# EAGLE design maho-splitter (EAGLE 4.16)
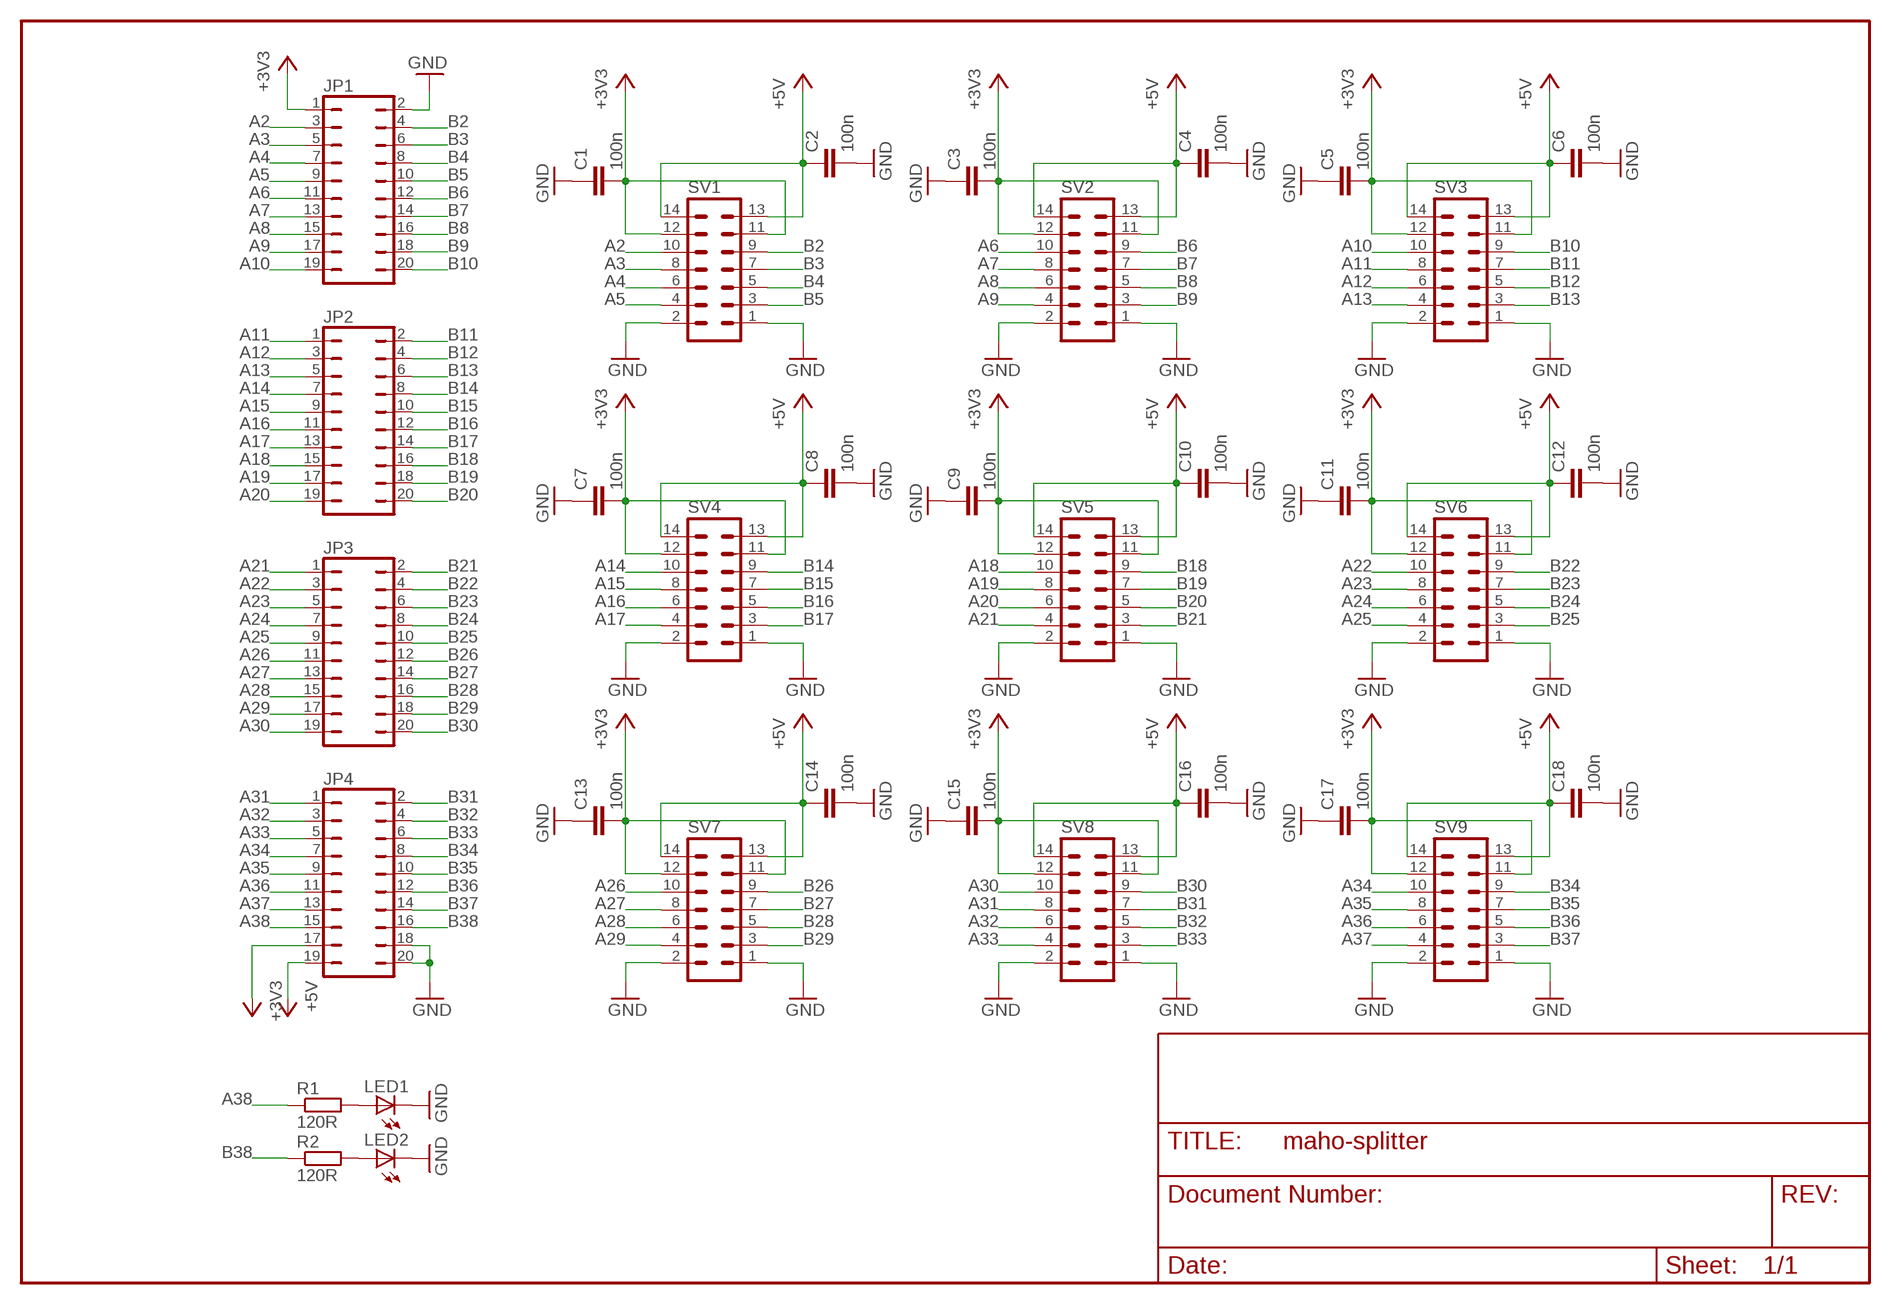
[diagram p0: schematic, sheet 1]

## Parts
C1  100n  C-EUC0603K  [C0603K]
C2  100n  C-EUC0603K  [C0603K]
C3  100n  C-EUC0603K  [C0603K]
C4  100n  C-EUC0603K  [C0603K]
C5  100n  C-EUC0603K  [C0603K]
C6  100n  C-EUC0603K  [C0603K]
C7  100n  C-EUC0603K  [C0603K]
C8  100n  C-EUC0603K  [C0603K]
C9  100n  C-EUC0603K  [C0603K]
C10  100n  C-EUC0603K  [C0603K]
C11  100n  C-EUC0603K  [C0603K]
C12  100n  C-EUC0603K  [C0603K]
C13  100n  C-EUC0603K  [C0603K]
C14  100n  C-EUC0603K  [C0603K]
C15  100n  C-EUC0603K  [C0603K]
C16  100n  C-EUC0603K  [C0603K]
C17  100n  C-EUC0603K  [C0603K]
C18  100n  C-EUC0603K  [C0603K]
JP1  JP10Q  [JP10Q]
JP2  JP10Q  [JP10Q]
JP3  JP10Q  [JP10Q]
JP4  JP10Q  [JP10Q]
LED1  LEDCHIP-LED0805  [CHIP-LED0805]
LED2  LEDCHIP-LED0805  [CHIP-LED0805]
R1  120R  R-EU_R0805  [R0805]
R2  120R  R-EU_R0805  [R0805]
SV1  ML14  [ML14]
SV2  ML14  [ML14]
SV3  ML14  [ML14]
SV4  ML14  [ML14]
SV5  ML14  [ML14]
SV6  ML14  [ML14]
SV7  ML14  [ML14]
SV8  ML14  [ML14]
SV9  ML14  [ML14]

## Nets
+3V3: C1.2 C3.2 C5.2 C7.2 C9.2 C11.2 C13.2 C15.2 C17.2 JP1.1 JP4.17 SV1.11 SV1.12 SV2.11 SV2.12 SV3.11 SV3.12 SV4.11 SV4.12 SV5.11 SV5.12 SV6.11 SV6.12 SV7.11 SV7.12 SV8.11 SV8.12 SV9.11 SV9.12
+5V: C2.1 C4.1 C6.1 C8.1 C10.1 C12.1 C14.1 C16.1 C18.1 JP4.19 SV1.13 SV1.14 SV2.13 SV2.14 SV3.13 SV3.14 SV4.13 SV4.14 SV5.13 SV5.14 SV6.13 SV6.14 SV7.13 SV7.14 SV8.13 SV8.14 SV9.13 SV9.14
A2: JP1.3 SV1.10
A3: JP1.5 SV1.8
A4: JP1.7 SV1.6
A5: JP1.9 SV1.4
A6: JP1.11 SV2.10
A7: JP1.13 SV2.8
A8: JP1.15 SV2.6
A9: JP1.17 SV2.4
A10: JP1.19 SV3.10
A11: JP2.1 SV3.8
A12: JP2.3 SV3.6
A13: JP2.5 SV3.4
A14: JP2.7 SV4.10
A15: JP2.9 SV4.8
A16: JP2.11 SV4.6
A17: JP2.13 SV4.4
A18: JP2.15 SV5.10
A19: JP2.17 SV5.8
A20: JP2.19 SV5.6
A21: JP3.1 SV5.4
A22: JP3.3 SV6.10
A23: JP3.5 SV6.8
A24: JP3.7 SV6.6
A25: JP3.9 SV6.4
A26: JP3.11 SV7.10
A27: JP3.13 SV7.8
A28: JP3.15 SV7.6
A29: JP3.17 SV7.4
A30: JP3.19 SV8.10
A31: JP4.1 SV8.8
A32: JP4.3 SV8.6
A33: JP4.5 SV8.4
A34: JP4.7 SV9.10
A35: JP4.9 SV9.8
A36: JP4.11 SV9.6
A37: JP4.13 SV9.4
A38: JP4.15 R1.1
B2: JP1.4 SV1.9
B3: JP1.6 SV1.7
B4: JP1.8 SV1.5
B5: JP1.10 SV1.3
B6: JP1.12 SV2.9
B7: JP1.14 SV2.7
B8: JP1.16 SV2.5
B9: JP1.18 SV2.3
B10: JP1.20 SV3.9
B11: JP2.2 SV3.7
B12: JP2.4 SV3.5
B13: JP2.6 SV3.3
B14: JP2.8 SV4.9
B15: JP2.10 SV4.7
B16: JP2.12 SV4.5
B17: JP2.14 SV4.3
B18: JP2.16 SV5.9
B19: JP2.18 SV5.7
B20: JP2.20 SV5.5
B21: JP3.2 SV5.3
B22: JP3.4 SV6.9
B23: JP3.6 SV6.7
B24: JP3.8 SV6.5
B25: JP3.10 SV6.3
B26: JP3.12 SV7.9
B27: JP3.14 SV7.7
B28: JP3.16 SV7.5
B29: JP3.18 SV7.3
B30: JP3.20 SV8.9
B31: JP4.2 SV8.7
B32: JP4.4 SV8.5
B33: JP4.6 SV8.3
B34: JP4.8 SV9.9
B35: JP4.10 SV9.7
B36: JP4.12 SV9.5
B37: JP4.14 SV9.3
B38: JP4.16 R2.1
GND: C1.1 C2.2 C3.1 C4.2 C5.1 C6.2 C7.1 C8.2 C9.1 C10.2 C11.1 C12.2 C13.1 C14.2 C15.1 C16.2 C17.1 C18.2 JP1.2 JP4.18 JP4.20 LED1.C LED2.C SV1.1 SV1.2 SV2.1 SV2.2 SV3.1 SV3.2 SV4.1 SV4.2 SV5.1 SV5.2 SV6.1 SV6.2 SV7.1 SV7.2 SV8.1 SV8.2 SV9.1 SV9.2
N$1: LED1.A R1.2
N$2: LED2.A R2.2

## Library data of the parts
C1-C18 = rcl:C-EU: CAPACITOR, European symbol
JP1-JP4 = jumper:JP10Q: JUMPER
LED1 LED2 = led:LED: LED OSRAM: - CHIPLED LG R971, LG N971, LY N971, LG Q971, LY Q971, LO R971, LY R971 LH N974, LH R974 LS Q976, LO Q976, LY Q976 LO Q996 - Hyper CHIPLED LW Q18S LB Q993, LB Q99A, LB R99A - SideLED LS A670, LO A670, LY A670, LG A670, LP A670 LB A673, LV A673, LT A673, LW A673 LH A674 LY A675 LS A676, LA A676, LO A676, LY A676, LW A676 LS A679, LY A679, LG A679 - Hyper Micro SIDELED® LS Y876, LA Y876, LO Y876, LY Y876 LT Y87S - SmartLED LW L88C, LW L88S LB L89C, LB L89S, LG L890 LS L89K, LO L89K, LY L89K LS L896, LA L896, LO L896, LY L896 - TOPLED LS T670, LO T670, LY T670, LG T670, LP T670 LSG T670, LSP T670, LSY T670, LOP T670, LYG T670 LG T671, LOG T671, LSG T671 LB T673, LV T673, LT T673, LW T673 LH T674 LS T676, LA T676, LO T676, LY T676, LB T676, LH T676, LSB T676, LW T676 LB T67C, LV T67C, LT T67C, LS T67K, LO T67K, LY T67K, LW E67C LS E67B, LA E67B, LO E67B, LY E67B, LB E67C, LV E67C, LT E67C LW T67C LS T679, LY T679, LG T679 LS T770, LO T770, LY T770, LG T770, LP T770 LB T773, LV T773, LT T773, LW T773 LH T774 LS E675, LA E675, LY E675, LS T675 LS T776, LA T776, LO T776, LY T776, LB T776 LHGB T686 LT T68C, LB T68C - Hyper Mini TOPLED® LB M676 - Mini TOPLED Santana® LG M470 LS M47K, LO M47K, LY M47K Source: http://www.osram.convergy.de - LUMILED® LXK2-PW12-R00, LXK2-PW12-S00, LXK2-PW14-U00, LXK2-PW14-V00 LXK2-PM12-R00, LXK2-PM12-S00, LXK2-PM14-U00 LXK2-PE12-Q00, LXK2-PE12-R00, LXK2-PE12-S00, LXK2-PE14-T00, LXK2-PE14-U00 LXK2-PB12-K00, LXK2-PB12-L00, LXK2-PB12-M00, LXK2-PB14-N00, LXK2-PB14-P00, LXK2-PB14-Q00 LXK2-PR12-L00, LXK2-PR12-M00, LXK2-PR14-Q00, LXK2-PR14-R00 LXK2-PD12-Q00, LXK2-PD12-R00, LXK2-PD12-S00 LXK2-PH12-R00, LXK2-PH12-S00 LXK2-PL12-P00, LXK2-PL12-Q00, LXK2-PL12-R00 Source: www.luxeon.com
R1 R2 = rcl:R-EU_: RESISTOR, European symbol
SV1-SV9 = con-harting-ml:ML14: HARTING

## Board
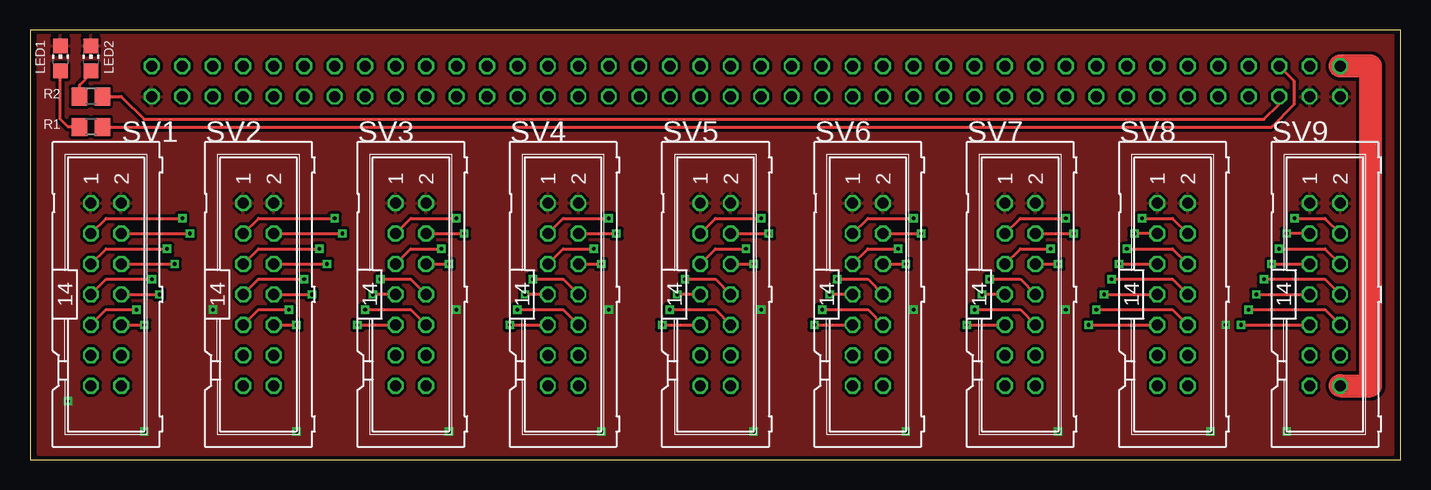
[diagram p1: board, top side]
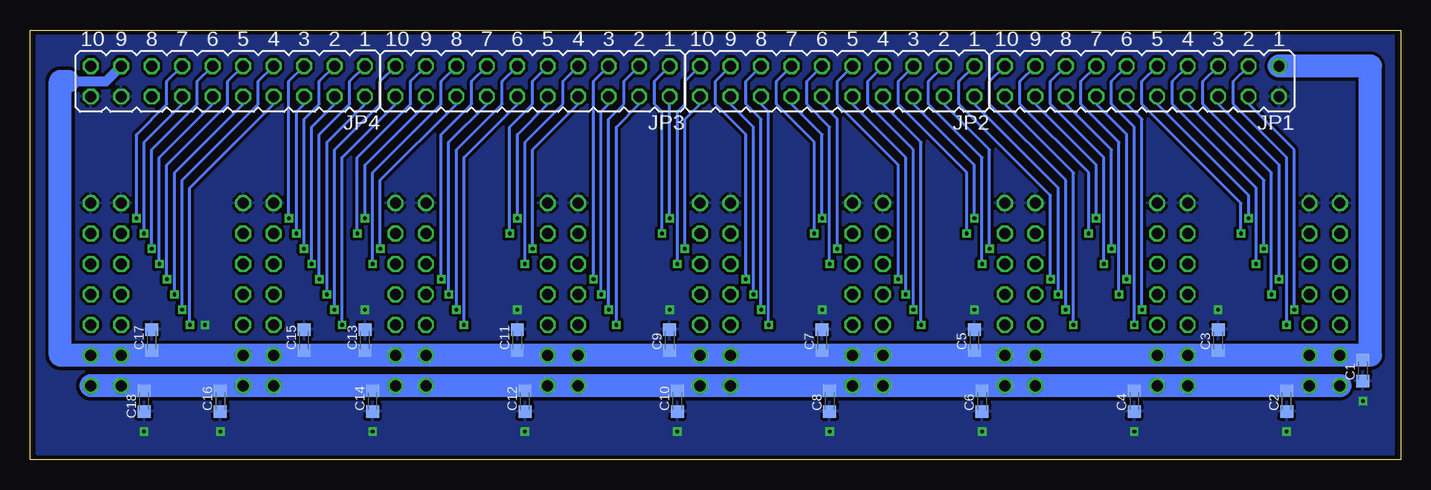
[diagram p2: board, bottom side, seen from below]

Size 114.28 x 35.87 mm. Coordinates in mm from the lower left corner, seen from the top.
Outline: 0,0 114.28,0 114.28,35.87 0,35.87 0,0
Copper layers (1+2*15+16): Top 0.035mm / dielectric 0.15mm / Route2 0.018mm / dielectric 1.5mm / Route15 0.018mm / dielectric 0.15mm / Bottom 0.035mm
Design rules "eurocircuits_class5": minimum track width 0.15mm, minimum drill 0.2mm, track to track 0.15mm, track to pad 0.15mm, pad to pad 0.15mm, via to via 0.15mm, smd to smd 0mil, copper to edge 0.2mm, drill to drill 0.2mm, minimum pad ring 0.2mm, minimum via ring 0.2mm, stop-mask expansion 4mil, vias tented up to drill 0mil, thermal gap 10mil

### Footprints (pad centres in the part's own frame; a part is rotated, then mirrored left to right if it is on the bottom)
C0603K = smd 1.05 x 1.08: 1 -0.875,0; 2 0.875,0
JP10Q = drill 0.914 octagon: 1 -11.43,-1.27; 2 -11.43,1.27; 3 -8.89,-1.27; 4 -8.89,1.27; 5 -6.35,-1.27; 6 -6.35,1.27; 7 -3.81,-1.27; 8 -3.81,1.27; 9 -1.27,-1.27; 10 -1.27,1.27; 11 1.27,-1.27; 12 1.27,1.27; 13 3.81,-1.27; 14 3.81,1.27; 15 6.35,-1.27; 16 6.35,1.27; 17 8.89,-1.27; 18 8.89,1.27; 19 11.43,-1.27; 20 11.43,1.27
CHIP-LED0805 = smd 1.2 x 1.2: A 0,-1.05; C 0,1.05
R0805 = smd 1.3 x 1.5: 1 -0.95,0; 2 0.95,0
ML14 = drill 0.914 octagon: 1 -7.62,-1.27; 2 -7.62,1.27; 3 -5.08,-1.27; 4 -5.08,1.27; 5 -2.54,-1.27; 6 -2.54,1.27; 7 0,-1.27; 8 0,1.27; 9 2.54,-1.27; 10 2.54,1.27; 11 5.08,-1.27; 12 5.08,1.27; 13 7.62,-1.27; 14 7.62,1.27

### Placement (x,y rotation side)
C1  3.17,7.46 90 bottom
C2  9.52,4.92 270 bottom
C3  15.24,10 270 bottom
C4  22.22,4.92 270 bottom
C5  35.55,10 270 bottom
C6  34.92,4.92 270 bottom
C7  48.26,10 270 bottom
C8  47.62,4.92 270 bottom
C9  60.96,10 270 bottom
C10  60.32,4.92 270 bottom
C11  73.66,10 270 bottom
C12  73.02,4.92 270 bottom
C13  86.35,10 270 bottom
C14  85.72,4.92 270 bottom
C15  91.44,10 270 bottom
C16  98.42,4.92 270 bottom
C17  104.13,10 270 bottom
C18  104.77,4.92 270 bottom
JP1  21.58,31.58 180 bottom
JP2  46.98,31.58 180 bottom
JP3  72.38,31.58 180 bottom
JP4  97.78,31.58 180 bottom
LED1  2.54,33.49 0 top
LED2  5.08,33.49 0 top
R1  5.08,27.77 180 top
R2  5.08,30.31 180 top
SV1  6.34,13.81 270 top
SV2  19.04,13.81 270 top
SV3  31.74,13.81 270 top
SV4  44.45,13.81 270 top
SV5  57.15,13.81 270 top
SV6  69.84,13.81 270 top
SV7  82.55,13.81 270 top
SV8  95.24,13.81 270 top
SV9  107.94,13.81 270 top

### Tracks (layer width: path | path; a pad name or v marks a point on that pad's centre or on a via)
+3V3
  Bottom 0.254: C5.2 35.16,8.73 SV3.12 | C7.2 47.86,8.73 SV4.12 | C9.2 60.56,8.73 SV5.12 | C11.2 73.26,8.73 SV6.12 | C17.2 104.53,8.73 SV9.11 | C13.2 85.96,8.73 SV7.12 | C15.2 91.83,8.73 SV8.11 | C1.2 3.56,8.73 SV1.11 | C3.2 15.24,9.36 15.87,8.73 SV2.11
  Bottom 0.813: JP4.17 107.94,31.58 111.12,31.58
  Bottom 1.93: JP1.1 2.54,32.85 2.54,8.73 SV1.11 SV1.12 SV2.11 SV2.12 SV3.11 SV3.12 SV4.11 SV4.12 SV5.11 SV5.12 SV6.11 SV6.12 SV7.11 SV7.12 SV8.11 SV8.12 SV9.11 SV9.12 111.75,8.73 111.75,31.58 111.12,31.58
+5V
  Top 1.93: SV9.14 111.75,6.18 111.75,32.85 JP4.19
  Bottom 0.254: C2.1 9.12,6.18 SV1.14 | C4.1 21.82,6.18 SV2.14 | C6.1 34.53,6.18 SV3.14 | C8.1 47.23,6.18 SV4.14 | C10.1 59.93,6.18 SV5.14 | C12.1 72.62,6.18 SV6.14 | C14.1 85.32,6.18 SV7.14 | C16.1 98.02,6.18 SV8.14 | C18.1 105.16,6.18 SV9.13
  Bottom 1.93: SV1.13 SV1.14 SV2.13 SV2.14 SV3.13 SV3.14 SV4.13 SV4.14 SV5.13 SV5.14 SV6.13 SV6.14 SV7.13 SV7.14 SV8.13 SV8.14 SV9.13 SV9.14
A2  (via drill 0.3)
  Top 0.254: SV1.10 v9.52,11.27
  Bottom 0.254: JP1.3 13.97,31.58 13.97,29.68 9.52,25.23 v9.52,11.27
A3  (via drill 0.3)
  Top 0.254: SV1.8 v10.79,13.81
  Bottom 0.254: JP1.5 16.5,31.58 16.5,29.68 10.79,23.96 v10.79,13.81
A4  (via drill 0.3)
  Top 0.254: SV1.6 v12.06,16.34
  Bottom 0.254: JP1.7 19.04,31.58 19.04,29.68 12.06,22.7 v12.06,16.34
A5  (via drill 0.3)
  Top 0.254: SV1.4 v13.33,18.88
  Bottom 0.254: JP1.9 21.58,31.58 21.58,29.68 13.33,21.42 v13.33,18.88
A6  (via drill 0.3)
  Top 0.254: SV2.10 v22.22,11.27
  Bottom 0.254: JP1.11 24.12,31.58 24.12,29.68 22.22,27.77 v22.22,11.27
A7  (via drill 0.3)
  Top 0.254: SV2.8 v23.49,13.81
  Bottom 0.254: JP1.13 26.66,31.58 26.66,29.68 23.49,26.5 v23.49,13.81
A8  (via drill 0.3)
  Top 0.254: SV2.6 v24.76,16.34
  Bottom 0.254: JP1.15 29.2,31.58 29.2,29.68 24.76,25.23 v24.76,16.34
A9  (via drill 0.3)
  Top 0.254: SV2.4 v26.03,18.88
  Bottom 0.254: JP1.17 31.74,31.58 31.74,29.68 26.03,23.96 v26.03,18.88
A10  (via drill 0.3)
  Top 0.254: SV3.10 31.74,12.54 v27.93,12.54
  Bottom 0.254: JP1.19 34.29,31.58 34.29,29.68 27.93,23.33 v27.93,12.54
A11  (via drill 0.3)
  Top 0.254: SV3.8 31.74,15.08 v29.2,15.08
  Bottom 0.254: JP2.1 36.83,31.58 36.83,29.68 29.2,22.06 v29.2,15.08
A12  (via drill 0.3)
  Top 0.254: SV3.6 v34.92,16.34
  Bottom 0.254: JP2.3 39.37,31.58 39.37,29.68 34.92,25.23 v34.92,16.34
A13  (via drill 0.3)
  Top 0.254: SV3.4 v36.19,18.88
  Bottom 0.254: JP2.5 41.91,31.58 41.91,29.68 36.19,23.96 v36.19,18.88
A14  (via drill 0.3)
  Top 0.254: v40.64,12.54 44.45,12.54 SV4.10
  Bottom 0.254: JP2.7 44.45,31.58 44.45,29.68 40.64,25.87 v40.64,12.54
A15  (via drill 0.3)
  Top 0.254: v41.91,15.08 44.45,15.08 SV4.8
  Bottom 0.254: JP2.9 46.98,31.58 46.98,29.68 41.91,24.6 v41.91,15.08
A16  (via drill 0.3)
  Top 0.254: SV4.6 v47.62,16.34
  Bottom 0.254: JP2.11 49.53,31.58 49.53,29.68 47.62,27.77 v47.62,16.34
A17  (via drill 0.3)
  Top 0.254: SV4.4 v48.89,18.88
  Bottom 0.254: JP2.13 52.07,31.58 52.07,29.68 48.89,26.5 v48.89,18.88
A18  (via drill 0.3)
  Top 0.254: v53.34,12.54 57.15,12.54 SV5.10
  Bottom 0.254: JP2.15 54.61,31.58 54.61,29.68 53.34,28.41 v53.34,12.54
A19  (via drill 0.3)
  Top 0.254: v54.61,15.08 57.15,15.08 SV5.8
  Bottom 0.254: JP2.17 57.15,31.58 57.15,29.68 54.61,27.14 v54.61,15.08
A20  (via drill 0.3)
  Top 0.254: SV5.6 v60.32,16.34
  Bottom 0.254: JP2.19 59.69,31.58 59.69,29.68 60.32,29.04 v60.32,16.34
A21  (via drill 0.3)
  Top 0.254: SV5.4 v61.59,18.88
  Bottom 0.254: JP3.1 62.23,31.58 62.23,29.68 61.59,29.04 v61.59,18.88
A22  (via drill 0.3)
  Top 0.254: v66.03,12.54 69.84,12.54 SV6.10
  Bottom 0.254: JP3.3 64.77,31.58 64.77,29.68 66.03,28.41 v66.03,12.54
A23  (via drill 0.3)
  Top 0.254: v67.3,15.08 69.84,15.08 SV6.8
  Bottom 0.254: JP3.5 67.3,31.58 v67.3,15.08
A24  (via drill 0.3)
  Top 0.254: SV6.6 v73.02,16.34
  Bottom 0.254: JP3.7 69.84,31.58 69.84,29.68 73.02,26.5 v73.02,16.34
A25  (via drill 0.3)
  Top 0.254: SV6.4 v74.29,18.88
  Bottom 0.254: JP3.9 72.38,31.58 72.38,29.68 74.29,27.77 v74.29,18.88
A26  (via drill 0.3)
  Top 0.254: v78.73,12.54 82.55,12.54 SV7.10
  Bottom 0.254: JP3.11 74.92,31.58 74.92,29.68 78.73,25.87 v78.73,12.54
A27  (via drill 0.3)
  Top 0.254: v80,15.08 82.55,15.08 SV7.8
  Bottom 0.254: JP3.13 77.46,31.58 77.46,29.68 80,27.14 v80,15.08
A28  (via drill 0.3)
  Top 0.254: SV7.6 v85.72,16.34
  Bottom 0.254: JP3.15 80,31.58 80,29.68 85.72,23.96 v85.72,16.34
A29  (via drill 0.3)
  Top 0.254: SV7.4 v86.99,18.88
  Bottom 0.254: JP3.17 82.55,31.58 82.55,29.68 86.99,25.23 v86.99,18.88
A30  (via drill 0.3)
  Top 0.254: v88.89,12.54 95.24,12.54 SV8.10
  Bottom 0.254: JP3.19 85.08,31.58 85.08,29.68 88.89,25.87 v88.89,12.54
A31  (via drill 0.3)
  Top 0.254: v90.16,15.08 95.24,15.08 SV8.8
  Bottom 0.254: JP4.1 87.62,31.58 87.62,29.68 90.16,27.14 v90.16,15.08
A32  (via drill 0.3)
  Top 0.254: v91.44,17.61 95.24,17.61 SV8.6
  Bottom 0.254: JP4.3 90.16,31.58 90.16,29.68 91.44,28.41 v91.44,17.61
A33  (via drill 0.3)
  Top 0.254: v92.7,20.15 95.24,20.15 SV8.4
  Bottom 0.254: JP4.5 92.7,31.58 v92.7,20.15
A34  (via drill 0.3)
  Top 0.254: v101.59,12.54 107.94,12.54 SV9.10
  Bottom 0.254: JP4.7 95.24,31.58 95.24,29.68 101.59,23.33 v101.59,12.54
A35  (via drill 0.3)
  Top 0.254: v102.86,15.08 107.94,15.08 SV9.8
  Bottom 0.254: JP4.9 97.78,31.58 97.78,29.68 102.86,24.6 v102.86,15.08
A36  (via drill 0.3)
  Top 0.254: v104.13,17.61 107.94,17.61 SV9.6
  Bottom 0.254: JP4.11 100.32,31.58 100.32,29.68 104.13,25.87 v104.13,17.61
A37  (via drill 0.3)
  Top 0.254: v105.41,20.15 107.94,20.15 SV9.4
  Bottom 0.254: JP4.13 102.86,31.58 102.86,29.68 105.41,27.14 v105.41,20.15
A38
  Top 0.254: R1.1 103.5,27.77 105.41,29.68 105.41,31.58 JP4.15
B2  (via drill 0.3)
  Top 0.254: v8.89,12.54 6.34,12.54 SV1.9
  Bottom 0.254: v8.89,12.54 8.89,25.87 12.7,29.68 JP1.4
B3  (via drill 0.3)
  Top 0.254: SV1.7 6.34,15.08 v10.16,15.08
  Bottom 0.254: JP1.6 15.24,29.68 10.16,24.6 v10.16,15.08
B4  (via drill 0.3)
  Top 0.254: SV1.5 6.34,17.61 v11.43,17.61
  Bottom 0.254: JP1.8 17.77,29.68 11.43,23.33 v11.43,17.61
B5  (via drill 0.3)
  Top 0.254: SV1.3 6.34,20.15 v12.7,20.15
  Bottom 0.254: JP1.10 20.31,29.68 12.7,22.06 v12.7,20.15
B6  (via drill 0.3)
  Top 0.254: v21.58,12.54 19.04,12.54 SV2.9
  Bottom 0.254: v21.58,12.54 21.58,28.41 22.86,29.68 JP1.12
B7  (via drill 0.3)
  Top 0.254: SV2.7 19.04,15.08 v22.86,15.08
  Bottom 0.254: JP1.14 25.39,29.68 22.86,27.14 v22.86,15.08
B8  (via drill 0.3)
  Top 0.254: SV2.5 19.04,17.61 v24.12,17.61
  Bottom 0.254: JP1.16 27.93,29.68 24.12,25.87 v24.12,17.61
B9  (via drill 0.3)
  Top 0.254: SV2.3 19.04,20.15 v25.39,20.15
  Bottom 0.254: JP1.18 30.47,29.68 25.39,24.6 v25.39,20.15
B10  (via drill 0.3)
  Top 0.254: v27.3,11.27 SV3.9
  Bottom 0.254: JP1.20 33.02,29.68 27.3,23.96 v27.3,11.27
B11  (via drill 0.3)
  Top 0.254: SV3.7 v28.57,13.81
  Bottom 0.254: JP2.2 35.55,29.68 28.57,22.7 v28.57,13.81
B12  (via drill 0.3)
  Top 0.254: SV3.5 31.74,17.61 v34.29,17.61
  Bottom 0.254: v34.29,17.61 34.29,25.87 38.1,29.68 JP2.4
B13  (via drill 0.3)
  Top 0.254: SV3.3 31.74,20.15 v35.55,20.15
  Bottom 0.254: JP2.6 40.64,29.68 35.55,24.6 v35.55,20.15
B14  (via drill 0.3)
  Top 0.254: v40,11.27 SV4.9
  Bottom 0.254: JP2.8 43.18,29.68 40,26.5 v40,11.27
B15  (via drill 0.3)
  Top 0.254: SV4.7 v41.27,13.81
  Bottom 0.254: JP2.10 45.72,29.68 41.27,25.23 v41.27,13.81
B16  (via drill 0.3)
  Top 0.254: v46.98,17.61 44.45,17.61 SV4.5
  Bottom 0.254: JP2.12 48.26,29.68 46.98,28.41 v46.98,17.61
B17  (via drill 0.3)
  Top 0.254: v48.26,20.15 44.45,20.15 SV4.3
  Bottom 0.254: JP2.14 50.8,29.68 48.26,27.14 v48.26,20.15
B18  (via drill 0.3)
  Top 0.254: v52.7,11.27 SV5.9
  Bottom 0.254: v52.7,11.27 52.7,29.04 53.34,29.68 JP2.16
B19  (via drill 0.3)
  Top 0.254: SV5.7 v53.97,13.81
  Bottom 0.254: JP2.18 55.88,29.68 53.97,27.77 v53.97,13.81
B20  (via drill 0.3)
  Top 0.254: v59.69,17.61 57.15,17.61 SV5.5
  Bottom 0.254: JP2.20 58.41,29.68 59.69,28.41 v59.69,17.61
B21  (via drill 0.3)
  Top 0.254: v60.96,20.15 57.15,20.15 SV5.3
  Bottom 0.254: v60.96,20.15 JP3.2
B22  (via drill 0.3)
  Top 0.254: v65.4,11.27 SV6.9
  Bottom 0.254: JP3.4 63.5,29.68 65.4,27.77 v65.4,11.27
B23  (via drill 0.3)
  Top 0.254: SV6.7 v66.67,13.81
  Bottom 0.254: JP3.6 66.03,29.68 66.67,29.04 v66.67,13.81
B24  (via drill 0.3)
  Top 0.254: v72.38,17.61 69.84,17.61 SV6.5
  Bottom 0.254: JP3.8 68.57,29.68 72.38,25.87 v72.38,17.61
B25  (via drill 0.3)
  Top 0.254: v73.66,20.15 69.84,20.15 SV6.3
  Bottom 0.254: JP3.10 71.11,29.68 73.66,27.14 v73.66,20.15
B26  (via drill 0.3)
  Top 0.254: v78.1,11.27 SV7.9
  Bottom 0.254: JP3.12 73.66,29.68 78.1,25.23 v78.1,11.27
B27  (via drill 0.3)
  Top 0.254: SV7.7 v79.37,13.81
  Bottom 0.254: JP3.14 76.19,29.68 79.37,26.5 v79.37,13.81
B28  (via drill 0.3)
  Top 0.254: SV7.5 82.55,17.61 v85.08,17.61
  Bottom 0.254: JP3.16 78.73,29.68 85.08,23.33 v85.08,17.61
B29  (via drill 0.3)
  Top 0.254: SV7.3 82.55,20.15 v86.35,20.15
  Bottom 0.254: JP3.18 81.27,29.68 86.35,24.6 v86.35,20.15
B30  (via drill 0.3)
  Top 0.254: v88.26,11.27 SV8.9
  Bottom 0.254: JP3.20 83.81,29.68 88.26,25.23 v88.26,11.27
B31  (via drill 0.3)
  Top 0.254: v89.53,13.81 SV8.7
  Bottom 0.254: JP4.2 86.35,29.68 89.53,26.5 v89.53,13.81
B32  (via drill 0.3)
  Top 0.254: v90.8,16.34 SV8.5
  Bottom 0.254: JP4.4 88.89,29.68 90.8,27.77 v90.8,16.34
B33  (via drill 0.3)
  Top 0.254: SV8.3 v92.07,18.88
  Bottom 0.254: JP4.6 91.44,29.68 92.07,29.04 v92.07,18.88
B34  (via drill 0.3)
  Top 0.254: v100.96,11.27 SV9.9
  Bottom 0.254: JP4.8 93.97,29.68 100.96,22.7 v100.96,11.27
B35  (via drill 0.3)
  Top 0.254: v102.23,13.81 SV9.7
  Bottom 0.254: JP4.10 96.52,29.68 102.23,23.96 v102.23,13.81
B36  (via drill 0.3)
  Top 0.254: v103.5,16.34 SV9.5
  Bottom 0.254: JP4.12 99.05,29.68 103.5,25.23 v103.5,16.34
B37  (via drill 0.3)
  Top 0.254: SV9.3 v104.77,18.88
  Bottom 0.254: JP4.14 101.59,29.68 104.77,26.5 v104.77,18.88
B38
  Top 0.254: JP4.16 104.13,29.68 102.86,28.41 9.52,28.41 7.62,30.31 R2.1
GND  (via drill 0.3)
  other vias: 15.24,12.54 9.52,2.38 3.17,4.92 22.22,2.38 34.92,2.38 47.62,2.38 60.32,2.38 73.02,2.38 85.72,2.38 98.42,2.38 104.77,2.38 99.69,11.27 86.35,12.54 73.66,12.54 60.96,12.54 48.26,12.54 35.55,12.54
  pour Bottom (isolate 0.254): 0.63,35.39 0.63,0.47 113.66,0.47 113.66,35.39
  pour Top (isolate 0.254): 0.63,35.39 0.63,0.47 113.66,0.47 113.66,35.39
N$1
  Top 0.254: LED1.A 2.54,28.41 3.17,27.77 R1.2
N$2
  Top 0.254: LED2.A 5.08,32.22 4.12,31.27 R2.2